# EAGLE design avr-isp-pdi-adapter (EAGLE 6.2)
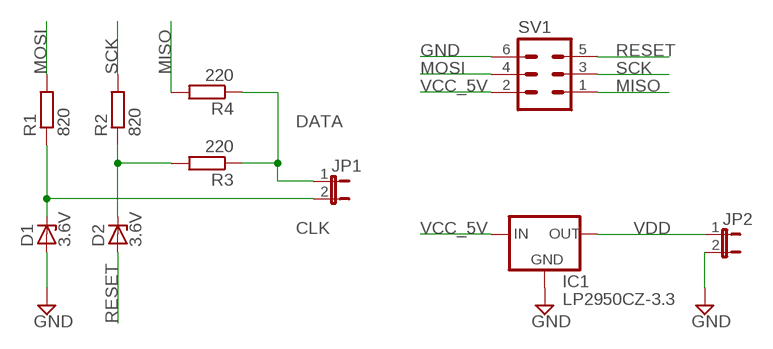
[diagram p0: schematic, sheet 1]

## Parts
D1  3.6V  ZENER-DIODEDO34-7  [DO34Z7]
D2  3.6V  ZENER-DIODEDO34-7  [DO34Z7]
IC1  LP2950CZ-3.3  [TO92]
JP1  JP1E  [JP1]
JP2  JP1E  [JP1]
R1  820  R-EU_0207/10  [0207/10]
R2  820  R-EU_0207/10  [0207/10]
R3  220  R-EU_0207/10  [0207/10]
R4  220  R-EU_0207/10  [0207/10]
SV1  MA03-2  [MA03-2]

## Nets
CLK: D1.C JP1.2 R1.1
DATA: JP1.1 R3.1 R4.1
GND: D1.A IC1.2(GND) JP2.2 SV1.6
MISO: R4.2 SV1.1
MOSI: R1.2 SV1.4
N$3: D2.C R2.1 R3.2
RESET: D2.A SV1.5
SCK: R2.2 SV1.3
VCC_5V: IC1.3(IN) SV1.2
VDD: IC1.1(OUT) JP2.1

## Library data of the parts
D1 D2 = diode:ZENER-DIODE: Z-Diode
IC1 = v-reg:LP2950?*: Source: http://cache.national.com/ds/LP/LP2950.pdf
JP1 JP2 = jumper:JP1E: JUMPER
R1-R4 = rcl:R-EU_: RESISTOR, European symbol
SV1 = con-lstb:MA03-2: PIN HEADER; OC_FARNELL: unknown; OC_NEWARK: unknown

## Board
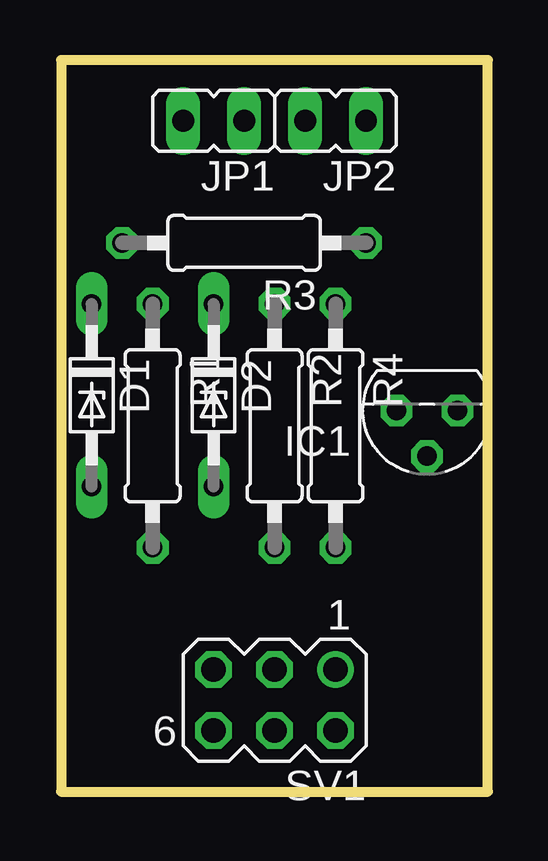
[diagram p1: board, top side]
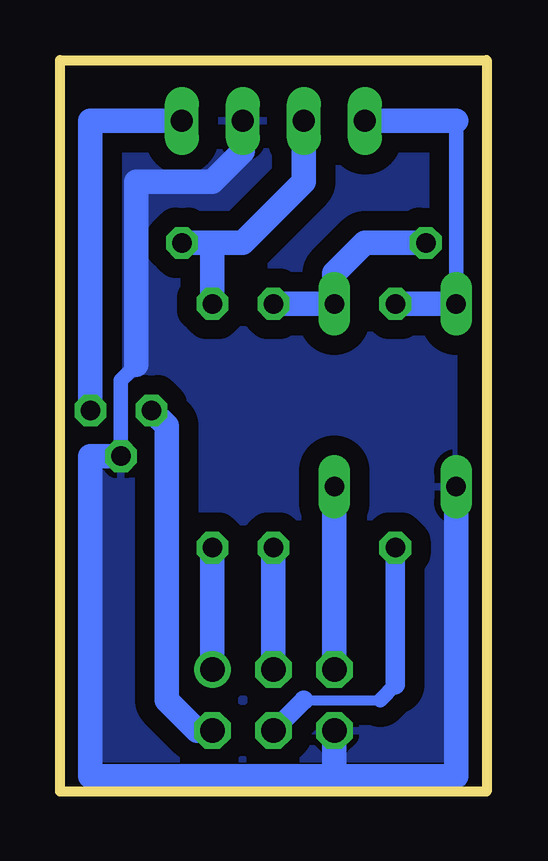
[diagram p2: board, bottom side, seen from below]

Size 17.78 x 30.48 mm. Coordinates in mm from the lower left corner, seen from the top.
Outline: 0,0 17.78,0 17.78,30.48 0,30.48 0,0
Copper layers (1*16): Top 0.035mm / dielectric 1.5mm / Bottom 0.035mm
Design rules: minimum track width 10mil, minimum drill 24mil, track to track 8mil, track to pad 8mil, pad to pad 8mil, via to via 8mil, smd to smd 8mil, copper to edge 40mil, drill to drill 8mil, minimum pad ring 10mil, minimum via ring 8mil, stop-mask expansion 4mil, vias tented up to drill 0mil, thermal gap 10mil

### Footprints (pad centres in the part's own frame; a part is rotated, then mirrored left to right if it is on the bottom)
DO34Z7 = drill 0.813 long: A 3.81,0; C -3.81,0
TO92 = drill 0.813 octagon: 1 -1.27,0; 2 0,1.905; 3 1.27,0
JP1 = drill 0.914 long: 1 0,-1.27; 2 0,1.27
0207/10 = drill 0.813 octagon: 1 -5.08,0; 2 5.08,0
MA03-2 = drill 1.016: 1 -2.54,-1.27 | drill 1.016 octagon: 2 -2.54,1.27; 3 0,-1.27; 4 0,1.27; 5 2.54,-1.27; 6 2.54,1.27

### Placement (x,y rotation side)
D1  1.27,16.51 270 top
D2  6.35,16.51 270 top
IC1  15.24,15.88 180 top
JP1  6.35,27.94 90 top
JP2  11.43,27.94 90 top
R1  3.81,15.24 270 top
R2  8.89,15.24 270 top
R3  7.62,22.86 180 top
R4  11.43,15.24 270 top
SV1  8.89,3.81 180 top

### Tracks (layer width: path | path; a pad name or v marks a point on that pad's centre or on a via)
CLK
  Bottom 0.61: 1.27,27.94 D1.C
  Bottom 1.016: R1.1 D1.C | JP1.2 1.27,27.94
DATA
  Bottom 1.016: JP1.1 7.62,25.4 10.16,22.86 11.43,22.86 | 11.43,22.86 R3.1 | R4.1 11.43,22.86
GND
  Bottom 0.61: IC1.2 15.24,17.14 14.61,17.78
  Bottom 1.016: D1.A 1.27,0.64 6.35,0.64 | 6.35,0.64 SV1.6 | IC1.2 16.51,13.97 16.51,0.64 6.35,0.64 | 14.61,17.78 14.61,25.4 11.43,25.4 10.16,26.67 JP2.2
  pour Bottom (isolate 0.813): 0,0 17.78,0 17.78,30.48 0,30.48
MISO
  Bottom 1.016: SV1.1 R4.2
MOSI
  Bottom 0.406: 7.62,3.81 4.45,3.81
  Bottom 0.61: 4.45,3.81 3.81,4.45
  Bottom 0.813: SV1.4 7.62,3.81 | 3.81,4.45 R1.2
N$3
  Bottom 1.016: R3.2 5.08,22.86 6.35,21.59 D2.C R2.1
RESET
  Bottom 1.016: SV1.5 D2.A
SCK
  Bottom 1.016: SV1.3 R2.2
VCC_5V
  Bottom 1.016: IC1.3 13.34,15.24 13.34,3.81 12.06,2.54 SV1.2
VDD
  Bottom 1.016: IC1.1 16.51,27.94 JP2.1